# EAGLE design Quad_Schematic (EAGLE 8.0.0)
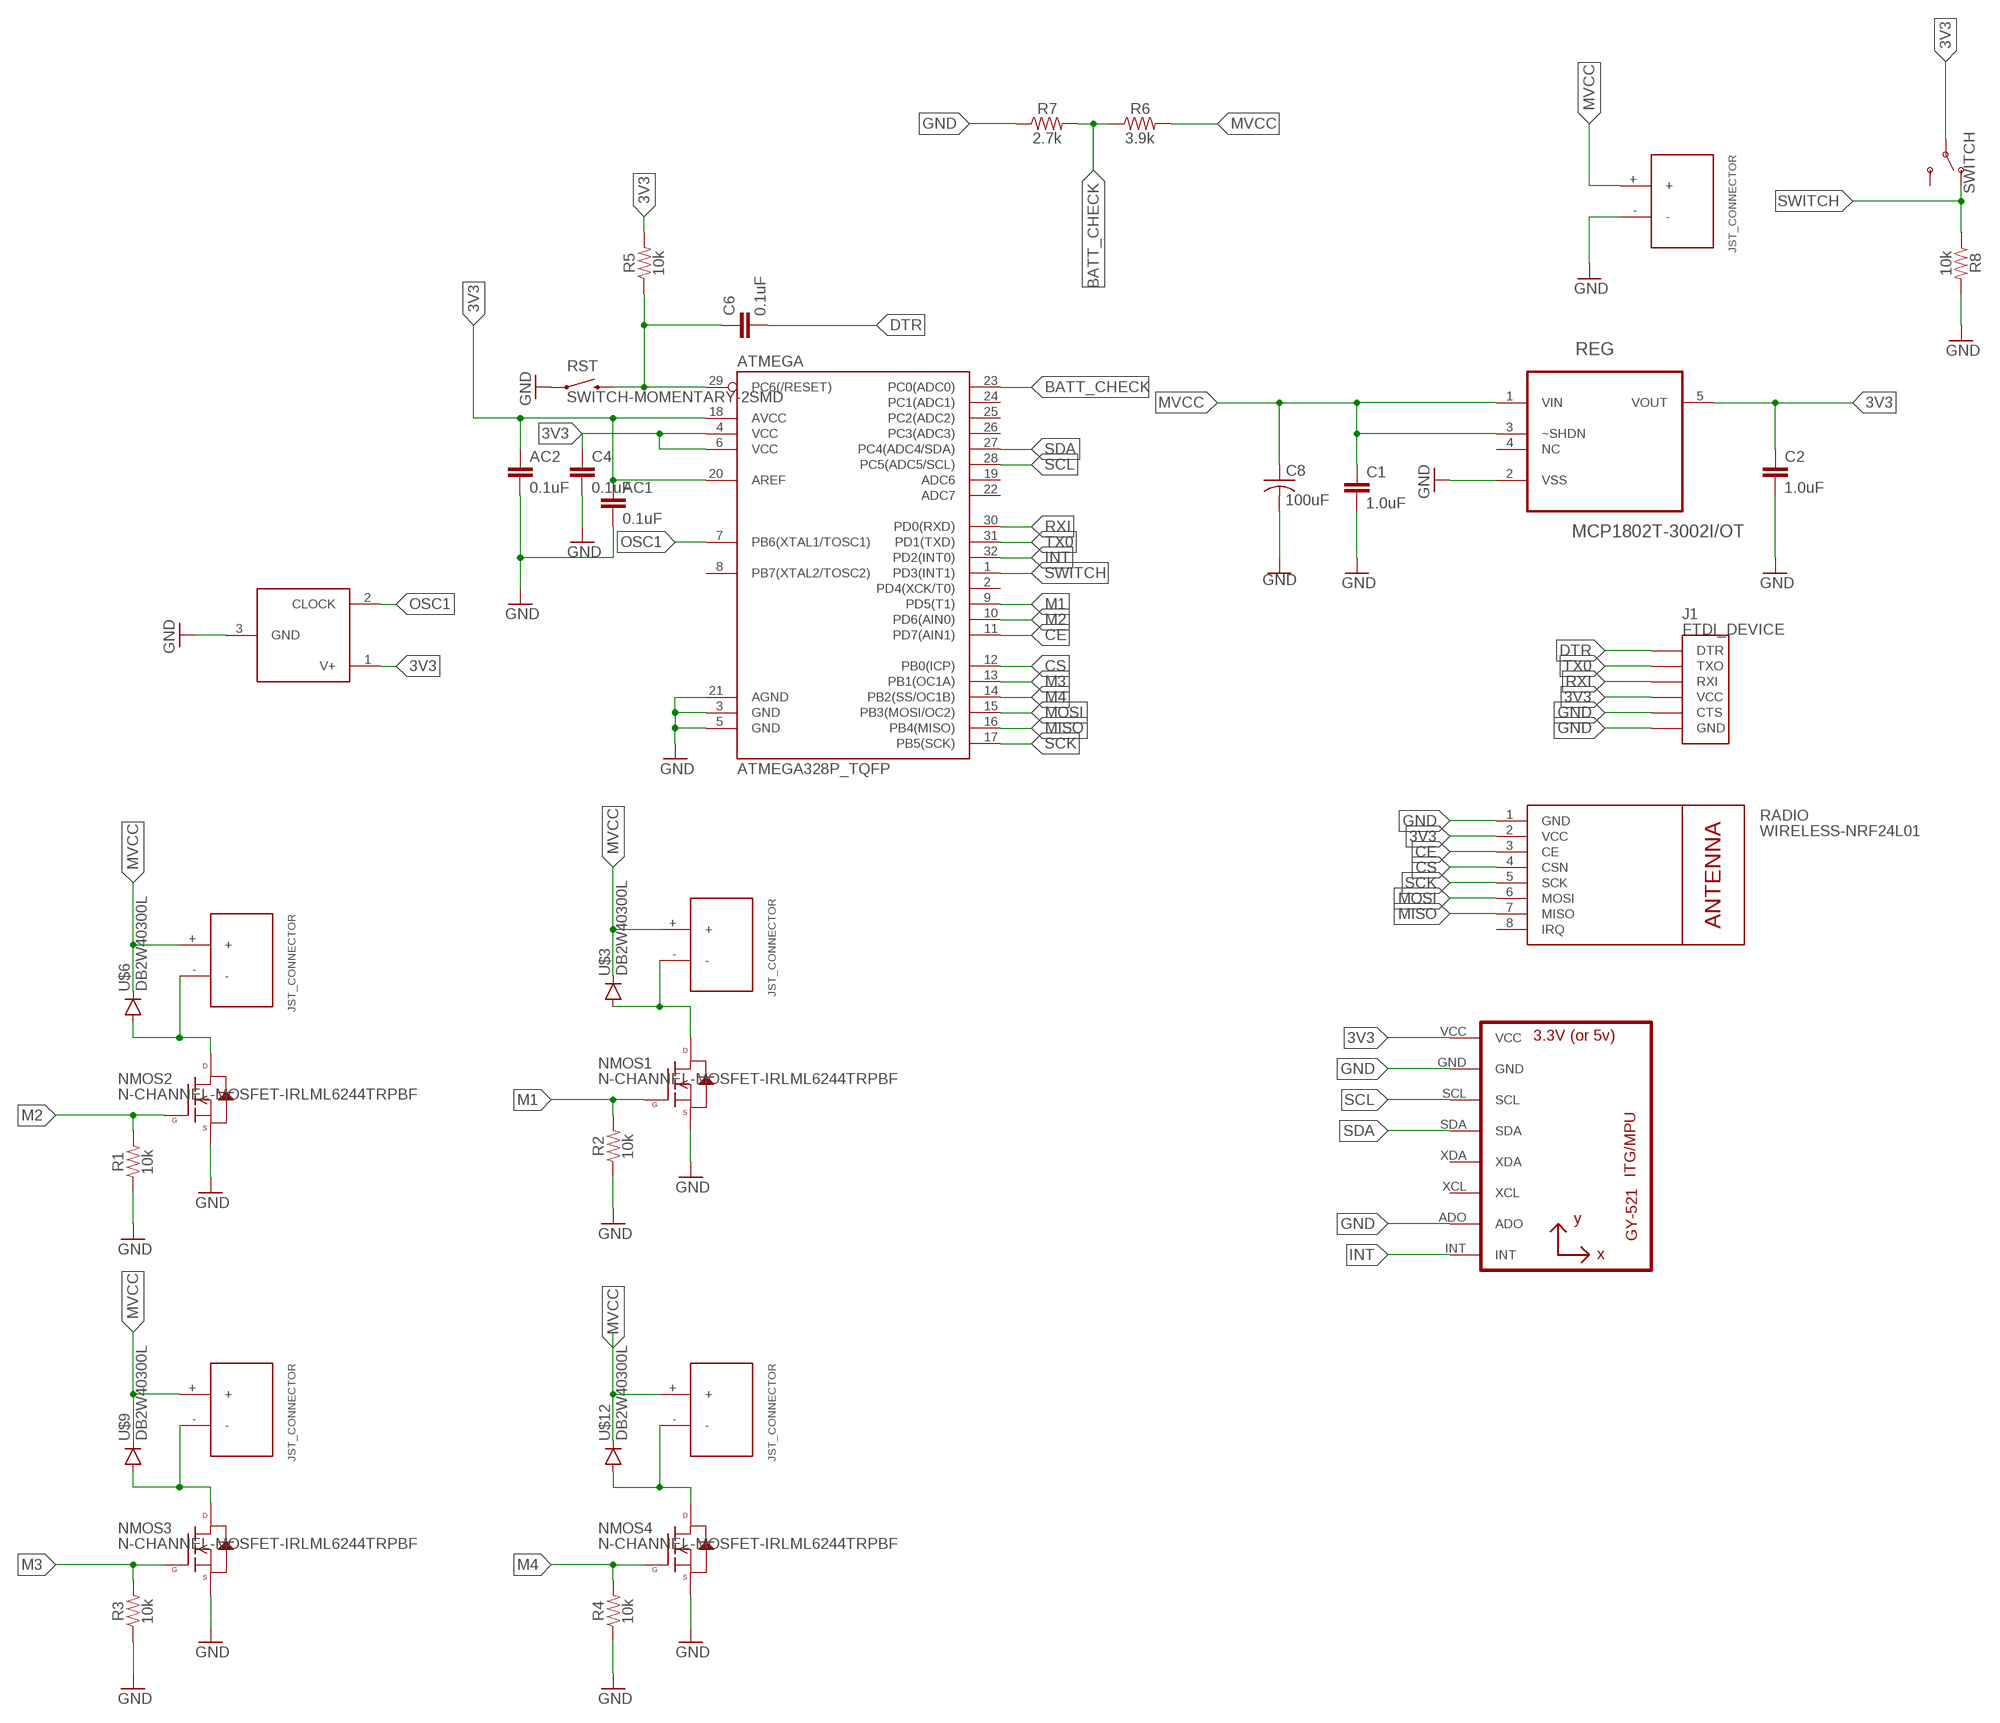
[diagram p0: schematic, sheet 1]

## Parts
AC1  0.1uF  0.1UF-0603-25V-5%  [0603]
AC2  0.1uF  0.1UF-0603-25V-5%  [0603]
ATMEGA  ATMEGA328P_TQFP  [TQFP32-08]
BATT  JST_CONNECTOR_FEMALE  [JST_CONNECTOR_FEMALE]
C1  1.0uF  1.0UF-0603-16V-10%  [0603]
C2  1.0uF  1.0UF-0603-16V-10%  [0603]
C4  0.1uF  0.1UF-0603-25V-5%  [0603]
C6  0.1uF  0.1UF-0603-25V-5%  [0603]
C8  100uF  C-USC1210  [C1210]
J1  FTDI_DEVICE  [FTDI_DEVICE_SIDE]
NMOS1  N-CHANNEL-MOSFET-IRLML6244TRPBF  [SOT23-3]
NMOS2  N-CHANNEL-MOSFET-IRLML6244TRPBF  [SOT23-3]
NMOS3  N-CHANNEL-MOSFET-IRLML6244TRPBF  [SOT23-3]
NMOS4  N-CHANNEL-MOSFET-IRLML6244TRPBF  [SOT23-3]
OSC  MAX7375  [SC70-3L]
R1  10k  10KOHM-0603-1/10W-1%  [0603]
R2  10k  10KOHM-0603-1/10W-1%  [0603]
R3  10k  10KOHM-0603-1/10W-1%  [0603]
R4  10k  10KOHM-0603-1/10W-1%  [0603]
R5  10k  10KOHM-0603-1/10W-1%  [0603]
R6  3.9k  6.8KOHM-0603-1/10W-1%  [0603]
R7  2.7k  5.6KOHM-0603-1/10W-1%  [0603]
R8  10k  10KOHM-0603-1/10W-1%  [0603]
RADIO  WIRELESS-NRF24L01  [WIRELESS-NRF24L01]
REG  MCP1802T-3002I/OT  [SOT95P270X145-5N]
RST  SWITCH-MOMENTARY-2SMD  [TACTILE-SWITCH-SMD]
SWITCH  SWITCH-SPDT-PTH-11.6X4.0MM  [SWITCH_SPDT_PTH_11.6X4.0MM]
U2  GY-521MPU6050  [GY-521]
U$2  JST_CONNECTOR_FEMALE  [JST_CONNECTOR_FEMALE]
U$3  DB2W40300L  [MINI2-F3-B]
U$5  JST_CONNECTOR_FEMALE  [JST_CONNECTOR_FEMALE]
U$6  DB2W40300L  [MINI2-F3-B]
U$8  JST_CONNECTOR_FEMALE  [JST_CONNECTOR_FEMALE]
U$9  DB2W40300L  [MINI2-F3-B]
U$11  JST_CONNECTOR_FEMALE  [JST_CONNECTOR_FEMALE]
U$12  DB2W40300L  [MINI2-F3-B]

## Nets
3V3: AC1.1 AC2.1 ATMEGA.4(VCC) ATMEGA.6(VCC) ATMEGA.18(AVCC) ATMEGA.20(AREF) C2.1 C4.1 J1.P$4(VCC) OSC.1(V+) R5.2 RADIO.2(VCC) REG.5(VOUT) SWITCH.2(P) U2.VCC
BATT_CHECK: ATMEGA.23(PC0(ADC0)) R6.1 R7.2
CE: ATMEGA.11(PD7(AIN1)) RADIO.3(CE)
CS: ATMEGA.12(PB0(ICP)) RADIO.4(CSN)
DTR: C6.2 J1.P$1(DTR)
GND: AC1.2 AC2.2 ATMEGA.3(GND) ATMEGA.5(GND) ATMEGA.21(AGND) BATT.- C1.2 C2.2 C4.2 C8.2 J1.P$5(CTS) J1.P$6(GND) NMOS1.2(S) NMOS2.2(S) NMOS3.2(S) NMOS4.2(S) OSC.3(GND) R1.1 R2.1 R3.1 R4.1 R7.1 R8.2 RADIO.1(GND) REG.2(VSS) RST.1 U2.ADO U2.GND
INT: ATMEGA.32(PD2(INT0)) U2.INT
M1: ATMEGA.9(PD5(T1)) NMOS1.1(G) R2.2
M2: ATMEGA.10(PD6(AIN0)) NMOS2.1(G) R1.2
M3: ATMEGA.13(PB1(OC1A)) NMOS3.1(G) R3.2
M4: ATMEGA.14(PB2(SS/OC1B)) NMOS4.1(G) R4.2
MISO: ATMEGA.16(PB4(MISO)) RADIO.7(MISO)
MOSI: ATMEGA.15(PB3(MOSI/OC2)) RADIO.6(MOSI)
MVCC: BATT.+ C1.1 C8.1 R6.2 REG.1(VIN) REG.3(~SHDN) U$2.+ U$3.NEG(GPIN) U$5.+ U$6.NEG(GPIN) U$8.+ U$9.NEG(GPIN) U$11.+ U$12.NEG(GPIN)
N$1: NMOS1.3(D) U$2.- U$3.POS(PPIN)
N$5: NMOS2.3(D) U$5.- U$6.POS(PPIN)
N$8: NMOS4.3(D) U$11.- U$12.POS(PPIN)
N$10: NMOS3.3(D) U$8.- U$9.POS(PPIN)
OSC1: ATMEGA.7(PB6(XTAL1/TOSC1)) OSC.2(CLOCK)
RESET: ATMEGA.29(PC6(/RESET)) C6.1 R5.1 RST.3
RXI: ATMEGA.30(PD0(RXD)) J1.P$3(RXI)
SCK: ATMEGA.17(PB5(SCK)) RADIO.5(SCK)
SCL: ATMEGA.28(PC5(ADC5/SCL)) U2.SCL
SDA: ATMEGA.27(PC4(ADC4/SDA)) U2.SDA
SWITCH: ATMEGA.1(PD3(INT1)) R8.1 SWITCH.1(O)
TX0: ATMEGA.31(PD1(TXD)) J1.P$2(TXO)
Unconnected: ATMEGA.2(PD4(XCK/T0)) ATMEGA.8(PB7(XTAL2/TOSC2)) ATMEGA.19(ADC6) ATMEGA.22(ADC7) ATMEGA.24(PC1(ADC1)) ATMEGA.25(PC2(ADC2)) ATMEGA.26(PC3(ADC3)) RADIO.8(IRQ) REG.4(NC) SWITCH.3(S) U2.XCL U2.XDA

## Library data of the parts
AC1 AC2 C4 C6 = SparkFun-Capacitors:0.1UF: 0.1µF ceramic capacitors A capacitor is a passive two-terminal electrical component used to store electrical energy temporarily in an electric field.; PROD_ID: CAP-08604
ATMEGA = quad:ATMEGA328P_TQFP; PROD_ID: IC-09069
BATT U$2 U$5 U$8 U$11 = quad:JST_CONNECTOR_FEMALE
C1 C2 = SparkFun-Capacitors:1.0UF: 1µF ceramic capacitors A capacitor is a passive two-terminal electrical component used to store electrical energy temporarily in an electric field.; PROD_ID: CAP-00868
C8 = rcl:C-US: CAPACITOR, American symbol
J1 = quad:FTDI_DEVICE: Connector which mates to FTDI basic or FTDI cable.
NMOS1-NMOS4 = quad:N-CHANNEL-MOSFET: N-Channel MOSFET Mode Field Effect Transistor; DATASHEET: http://www.mouser.com/ds/2/196/irlml6244pbf-936666.pdf; MOUSER: 942-IRLML6244TRPBF; URL: http://www.mouser.com/Search/ProductDetail.aspx?R=IRLML6244TRPBFvirtualkey57370000virtualkey942-IRLML6244TRPBF
OSC = quad:MAX7375
R1-R5 R8 = SparkFun-Resistors:10KOHM: 10kΩ resistor A resistor is a passive two-terminal electrical component that implements electrical resistance as a circuit element. Resistors act to reduce current flow, and, at the same time, act to lower voltage levels within circuits. - Wikipedia; PROD_ID: RES-00824
R6 = SparkFun-Resistors:6.8KOHM: 6.8kΩ resistor A resistor is a passive two-terminal electrical component that implements electrical resistance as a circuit element. Resistors act to reduce current flow, and, at the same time, act to lower voltage levels within circuits. - Wikipedia; PROD_ID: RES-08597; VALUE: 6.8k
R7 = SparkFun-Resistors:5.6KOHM: 5.6kΩ resistor A resistor is a passive two-terminal electrical component that implements electrical resistance as a circuit element. Resistors act to reduce current flow, and, at the same time, act to lower voltage levels within circuits. - Wikipedia; PROD_ID: RES-12378; VALUE: 5.6k
RADIO = quad:WIRELESS-NRF24L01: 2.4 GHz Wireless Module based on NRF24L01 chip
REG = quad:MCP1802T-3002I/OT: Low Quiescent Current LDO; MPN: MCP1802T-3002I/OT; OC_FARNELL: 1578373; OC_NEWARK: 54M4837; PACKAGE: SOT-5; SUPPLIER: Microchip
RST = quad:SWITCH-MOMENTARY-2: Various NO switches- pushbuttons, reed, etc; PROD_ID: SWCH-08247
SWITCH = SparkFun-Switches:SWITCH-SPDT: Single Pole, Double Throw (SPDT) Switch Single-pole, double-throw (SPDT) switch. Variant Overview SMD-AYZ0202 Surface Mount DPDT Switch <https://www.sparkfun.com/products/597> (COM-00597) Used on e.g. LilyPad Arduino USB - ATmega32U4 Board <https://www.sparkfun.com/products/12049> PTH-11.6X4.0MM SPDT Mini Power Switch <https://www.sparkfun.com/products/102> (COM-00102) Used on e.g. SparkFun Simon Says - Through-Hole Soldering Kit <https://www.sparkfun.com/products/10547> (KIT-10547) PTH-11.6X4.0MM-KIT KIT version of SPDT Mini Power Switch - Simplifies soldering by removing tStop of switch pins - only one side can be soldered. PTH-11.6X4.0MM-LOCK LOCK version of SPDT Mini Power Switch - Offset pins hold switch in place for easier soldering. SMD-RIGHT-ANGLE Surface Mount Right Angle Switch <https://www.sparkfun.com/products/10860> (COM-10860) Used on e.g. SparkFun ESP8266 Thing <https://www.sparkfun.com/products/13231>; PROD_ID: SWCH-08261; SF_SKU: COM-00102
U2 = quad:GY-521
U$3 U$6 U$9 U$12 = quad:DB2W40300L

## Board
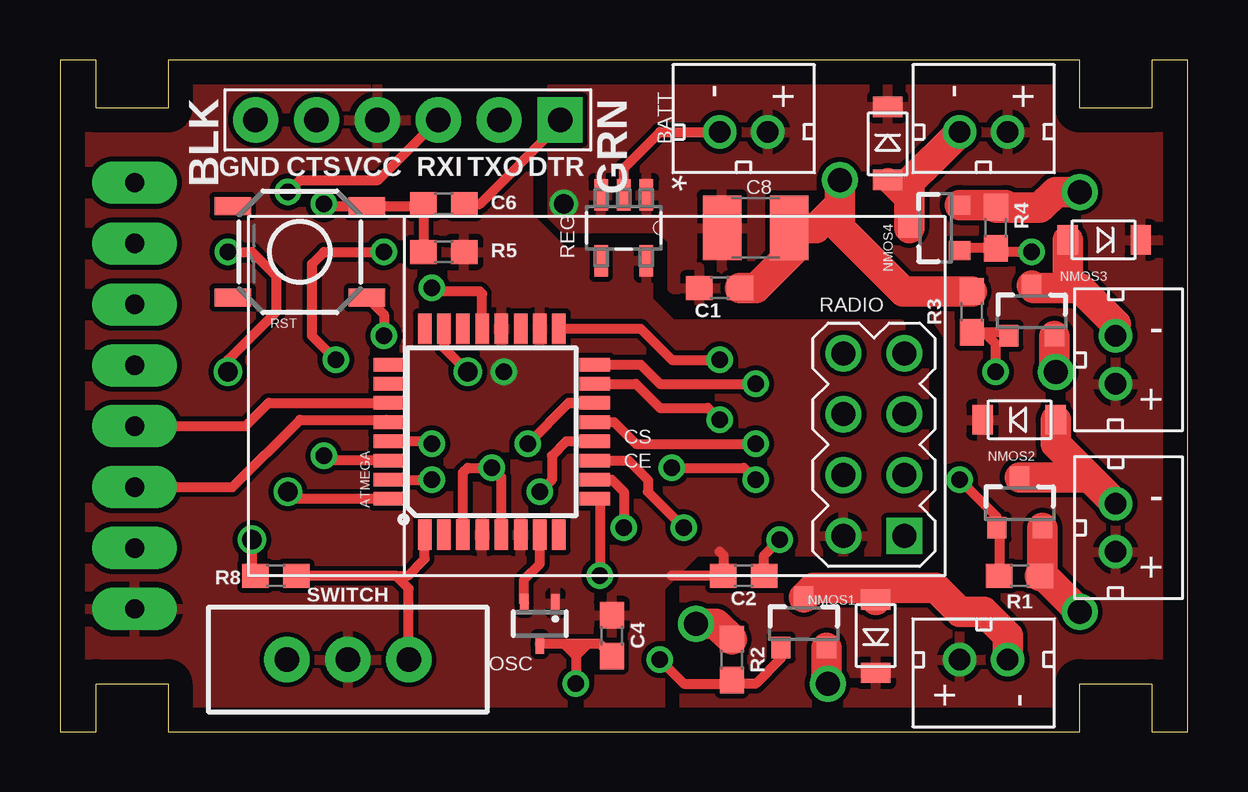
[diagram p1: board, top side]
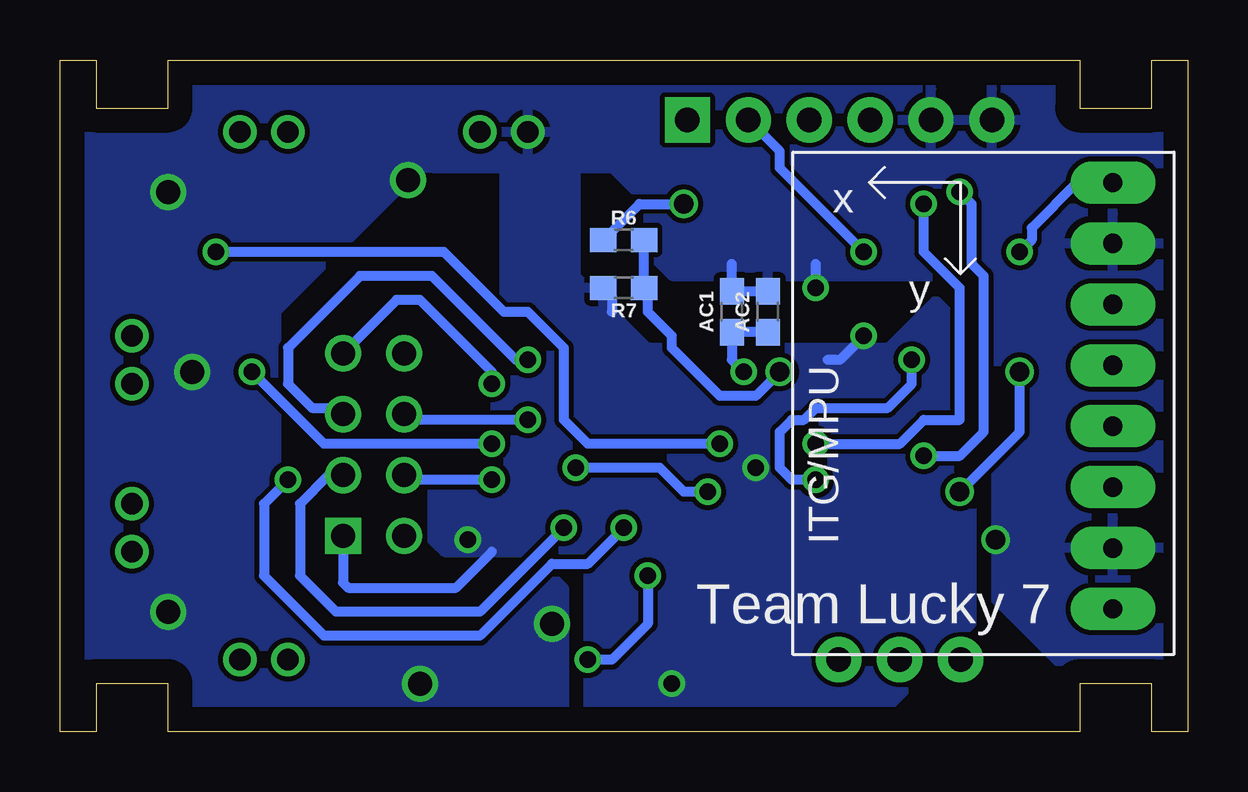
[diagram p2: board, bottom side, seen from below]

Size 47 x 28 mm. Coordinates in mm from the lower left corner, seen from the top.
Outline: 0,0 1.5,0 1.5,2 4.5,2 4.5,0 42.5,0 42.5,2 45.5,2 45.5,0 47,0 47,28 45.5,28 45.5,26 42.5,26 42.5,28 4.5,28 4.5,26 1.5,26 1.5,28 0,28 0,0
Copper layers (1*16): Top 0.035mm / dielectric 1.5mm / Bottom 0.035mm
Design rules "default": minimum track width 10mil, minimum drill 24mil, track to track 8mil, track to pad 8mil, pad to pad 8mil, via to via 8mil, smd to smd 8mil, copper to edge 40mil, drill to drill 8mil, minimum pad ring 10mil, minimum via ring 8mil, stop-mask expansion 4mil, vias tented up to drill 0mil, thermal gap 10mil

### Footprints (pad centres in the part's own frame; a part is rotated, then mirrored left to right if it is on the bottom)
0603 = smd 1.1 x 1: 1 -0.85,0; 2 0.85,0
TQFP32-08 = smd 1.27 x 0.559: 1 -4.293,2.8; 2 -4.293,2; 3 -4.293,1.2; 4 -4.293,0.4; 5 -4.293,-0.4; 6 -4.293,-1.2; 7 -4.293,-2; 8 -4.293,-2.8; 17 4.293,-2.8; 18 4.293,-2; 19 4.293,-1.2; 20 4.293,-0.4; 21 4.293,0.4; 22 4.293,1.2; 23 4.293,2; 24 4.293,2.8 | smd 0.559 x 1.27: 9 -2.8,-4.293; 10 -2,-4.293; 11 -1.2,-4.293; 12 -0.4,-4.293; 13 0.4,-4.293; 14 1.2,-4.293; 15 2,-4.293; 16 2.8,-4.293; 25 2.8,4.293; 26 2,4.293; 27 1.2,4.293; 28 0.4,4.293; 29 -0.4,4.293; 30 -1.2,4.293; 31 -2,4.293; 32 -2.8,4.293
JST_CONNECTOR_FEMALE = drill 0.889: + 0,1; - 0,-1
C1210 = smd 1.6 x 2.7: 1 -1.4,0; 2 1.4,0
FTDI_DEVICE_SIDE = drill 1.016 pad 1.88 square: P$1 -6.35,0 | drill 1.016 pad 1.88: P$2 -3.81,0; P$3 -1.27,0; P$4 1.27,0; P$5 3.81,0; P$6 6.35,0
SOT23-3 = smd 0.8 x 0.9: 1 -0.95,-1; 2 0.95,-1; 3 0,1.1
SC70-3L = smd 0.35 x 0.8: 1 -0.65,-0.85; 2 0.65,-0.85; 3 0,0.85
WIRELESS-NRF24L01 = drill 1 square: 1 -12.7,6.35 | drill 1: 2 -10.16,6.35; 3 -12.7,3.81; 4 -10.16,3.81; 5 -12.7,1.27; 6 -10.16,1.27; 7 -12.7,-1.27; 8 -10.16,-1.27
SOT95P270X145-5N = smd 1.321 x 0.559: 1 -1.372,0.94; 2 -1.372,0; 3 -1.372,-0.94; 4 1.372,-0.94; 5 1.372,0.94
TACTILE-SWITCH-SMD = smd 1.524 x 0.762: 1 -2.794,1.905; 2 2.794,1.905; 3 -2.794,-1.905; 4 2.794,-1.905
SWITCH_SPDT_PTH_11.6X4.0MM = drill 1.016 pad 1.88: 1 0,2.54; 2 0,0; 3 0,-2.54
GY-521 = drill 0.8 pad 1.778 long: ADO -8.89,-6.35; GND -8.89,6.35; INT -8.89,-8.89; SCL -8.89,3.81; SDA -8.89,1.27; VCC -8.89,8.89; XCL -8.89,-3.81; XDA -8.89,-1.27
MINI2-F3-B = smd 1.22 x 0.85: NEG 0,1.55; POS 0,-1.5

### Placement (x,y rotation side)
AC1  19,17.5 90 bottom
AC2  17.5,17.5 90 bottom
ATMEGA  18,12.5 90 top
BATT  28.5,25 270 top
C1  27.5,18.5 0 top
C2  28.5,6.5 0 top
C4  23,4 270 top
C6  16,22 0 top
C8  29,21 0 top
J1  14.5,25.5 180 top
NMOS1  31,4.5 0 top
NMOS2  40,9.5 0 top
NMOS3  40.5,17.5 0 top
NMOS4  36.5,21 90 top
OSC  20,4.5 180 top
R1  40,6.5 180 top
R2  28,3 270 top
R3  38,17.5 270 top
R4  39,21 270 top
R5  16,20 0 top
R6  23.5,20.5 180 bottom
R7  23.5,18.5 0 bottom
R8  9,6.5 180 top
RADIO  22.5,14.5 180 top
REG  23.5,21 270 top
RST  10,20 180 top
SWITCH  12,3 270 top
U2  12,14 180 bottom
U$2  38.5,3 90 top
U$3  34,4 180 top
U$5  44,8.5 180 top
U$6  40,13 90 top
U$8  44,15.5 180 top
U$9  43.5,20.5 270 top
U$11  38.5,25 270 top
U$12  34.5,24.5 0 top

### Tracks (layer width: path | path; a pad name or v marks a point on that pad's centre or on a via)
3V3  (via drill 0.7)
  Top 0.406: 27.5,7.5 27.65,7.35 C2.1 25.5,6.5
  Bottom 0.406: AC2.1 AC1.1 19,15.5 v18.5,15
  pour Top: 19.5,28 19.5,21.5 21,20 24.5,20 24.5,18 25.5,17 35,17 36,16 36,8 35.5,7.5 26.5,7.5 25,6 25,0 4.5,0 4.5,2 0,2 0,26 4.5,26 4.5,28
BATT_CHECK  (via drill 0.8)
  Top 0.406: ATMEGA.23 16,16 v17,15
  Bottom 0.406: R6.1 R7.2 22.5,18.35 22.5,17.5 21.5,16.5 21.5,16 19.5,14 18,14 v17,15
CE  (via drill 0.7)
  Top 0.406: ATMEGA.11 23.7,11.3 24.5,10.5 24.5,10 v26,8.5
  Bottom 0.406: RADIO.3 35.81,10.69 37,9.5 37,6.5 35.5,5 29.5,5 v26,8.5
CS  (via drill 0.7)
  Top 0.406: 21.6,12.1 ATMEGA.12 21.1,12.1 20.5,11.5 20.5,10.5 v20,10 | v25.5,11 28.5,11 v29,10.5
  Bottom 0.406: v29,10.5 32.47,10.5 RADIO.4 | v20,10 21,10 22,11 v25.5,11
DTR
  Top 0.406: C6.2 17.5,22 20.85,25.35 J1.P$1
GND  (via drill 0.7, 0.8, 1)
  Top 0.406: 21,3.65 OSC.3 | 22,3.65 22.5,3.65 C4.2 | 12.6,18.09 RST.1 13.5,17.39 v13.5,16.5 | 31.95,2.05 v32,2 | ATMEGA.5 18.4,10.6 v18,11 17,11 16.8,10.8 ATMEGA.3 | R8.2 8,6.65 v8,8 | 21.5,3.65 v21.5,2 | 21,3.65 21.5,3.15 22,3.65 | 21.5,3.65 21,3.65 | C8.2 30.5,20.9 30.5,20 | 22,3.65 21.5,3.65 | REG.2 23.5,23.5 25,25 BATT.- | C2.2 29.35,7.35 v30,8 | ATMEGA.21 17.6,18.25 AC2.2 15.65,18.35 v15.5,18.5
  Top 1.27: NMOS4.2 39.4,21.95 R4.1 40.85,21.85 41.5,22.5 v42.5,22.5 | R3.1 35.15,18.35 32.5,21 32.5,22 | NMOS2.2 40.95,6.6 R1.1 41,6.5 v42.5,5 | NMOS1.2 31.95,2.05 | 32.5,22 v32.5,23 | C8.2 31.5,21 32.5,22 | NMOS3.2 41.45,15.05 v41.5,15 | C1.2 29,18.5 30.5,20 | R2.1 27.35,4.5 v26.5,4.5
  Bottom 0.406: RADIO.1 35.2,6.2 35,6 30.5,6 29,7.5 | R7.1 24,18.15 24,17.5 | v13.5,16.5 14.5,15.5 15,15.5 | AC2.2 AC1.2 19,19.5 | v15.5,18.5 15.5,19.5
  pour Bottom: 31.5,28 31.5,23.5 24,23.5 22.5,22 22.5,20 21.5,19 10,19 8,17 8,5.5 4.5,2 0,2 0,26 4.5,26 6.5,28
  pour Bottom: 26,6 26.5,6.5 27.5,6.5
  pour Bottom: 25.5,28 28.5,28 28.5,14 31.5,11 31.5,8 31,7.5 26,7.5 25,6.5 25,0.5 24.5,0 13.5,0 9,4.5 9,16.5 10.5,18 12.5,16 22.5,16 25.5,19
  pour Bottom: 25.5,28 25.5,23.5 31.5,23.5 32,23.5 38,17.5 38,6.5 36,4.5 30,4.5 29.5,4.5 27.5,6.5 26.5,6.5 26,6 26,0.5 26.5,0 40.5,0 42.5,2 47,2 47,26 42.5,26 40.5,28
INT  (via drill 0.7, 0.8)
  Top 0.406: ATMEGA.32 9.8,9.7 v9.5,10 | v7,15 7,15.5 9,17.5 9,19 8,20 v7,20
  Bottom 0.406: v9.5,10 7,12.5 v7,15 | U2.INT 4.61,22.89 6.5,21 6.5,20.5 v7,20
M1  (via drill 0.7)
  Top 0.406: ATMEGA.9 22.5,9.49 v22.5,6.5 | v25,3 26,2 27.85,2 R2.2 28.15,2 29,2 30.05,3.05 NMOS1.1
  Bottom 0.406: v22.5,6.5 22.5,4.5 24,3 v25,3
M2  (via drill 0.7)
  Top 0.406: R1.2 39.15,8.4 NMOS2.1 39.05,8.95 v37.5,10.5 | ATMEGA.10 23,10.5 23.5,10 v23.5,8.5
  Bottom 0.406: v37.5,10.5 38.5,9.5 38.5,6.5 36,4 29.5,4 26.5,7 25,7 v23.5,8.5
M3  (via drill 0.7)
  Top 0.406: 38.5,16.65 R3.2 | 38.5,16.65 39.4,16.65 NMOS3.1 | v39,15 39,16.15 38.5,16.65 | ATMEGA.13 23.1,12.9 24,12 v29,12
  Bottom 0.406: v29,12 36,12 v39,15
M4  (via drill 0.7)
  Top 0.406: NMOS4.1 37.6,20.15 R4.2 39.15,20 v40.5,20 | 21.2,13.7 ATMEGA.14 21.2,13.7 | 21.2,13.7 v19.5,12
  Bottom 0.406: v40.5,20 31,20 28.5,17.5 27.5,17.5 26,16 26,13 25,12 v19.5,12
MISO  (via drill 0.7)
  Top 0.406: ATMEGA.16 24.2,15.3 25,14.5 v29,14.5
  Bottom 0.406: 35,15.97 RADIO.7 32.97,18 32,18 29,15 v29,14.5
MOSI  (via drill 0.7)
  Top 0.406: ATMEGA.15 24,14.5 25,13.5 27,13.5 v27.5,13
  Bottom 0.406: v27.5,13 32.43,13 RADIO.6
MVCC  (via drill 0.8)
  Bottom 0.406: R6.2 22.85,22 v21,22
  pour Top: 20.5,28 20.5,21.5 21,21 25,21 25.5,20.5 25.5,18.5 26.5,18 36,18 37,16.5 37,8 36,6.5 27,6.5 26,6 26,0 42.5,0 42.5,2 47,2 47,26 42.5,26 42.5,28
N$1
  Top 0.406: NMOS1.3 31.1,5.5
  Top 1.27: U$2.- 39.5,4 38.5,5 37.5,5 36.5,6 34.5,6 | 34.5,6 U$3.POS | 34.5,6 31.4,6 NMOS1.3
N$5
  Top 1.27: 42.9,10.6 NMOS2.3 | 42.9,10.6 U$5.- | U$6.POS 41.5,12 42.9,10.6
N$8
  Top 1.016: NMOS4.3 35.4,22.1 U$12.POS
  Top 1.27: 36,23.5 U$11.- 35.4,22.9 NMOS4.3
N$10
  Top 0.406: U$8.- 44,17 | 42,19 41.5,18.5
  Top 1.27: 44,17 42.5,18.5 41.5,18.5 40.6,18.5 NMOS3.3 | U$9.POS 42,19
OSC1
  Top 0.406: OSC.2 19.35,6.35 20,7 ATMEGA.7
RESET  (via drill 0.7)
  Top 0.406: R5.1 C6.1 15.05,21.91 RST.3 11.1,21.91 v11,22 | v15.5,12 15.4,12.1 ATMEGA.29
  Bottom 0.406: v15.5,12 12,12 11,13 9.5,13 9.5,18.5 11,20 v11,22
RXI  (via drill 0.7)
  Top 0.406: 15.5,25.5 J1.P$3 13.27,23 10,23 v9.5,22.5 | v11,11.5 11.2,11.3 ATMEGA.30
  Bottom 0.406: v11,11.5 9.5,11.5 8.5,12.5 8.5,19 9,19.5 9,22 v9.5,22.5
SCK  (via drill 0.7)
  Top 0.406: ATMEGA.17 24.21,16.79 25.5,15.5 v27.5,15.5
  Bottom 0.406: RADIO.5 35.47,13.5 36.5,13.5 37.5,14.5 37.5,16 34.5,19 31.5,19 28,15.5 v27.5,15.5
SCL
  Top 0.406: U2.SCL 7.19,10.19 10,13 13.61,13 ATMEGA.28
SDA
  Top 0.406: U2.SDA 7.73,12.73 8.7,13.7 ATMEGA.27
SWITCH
  Top 0.406: 14,6.5 14.5,6.5 15.2,7.2 ATMEGA.1 | 14,6.5 R8.1 | SWITCH.1 14.54,5.96 14,6.5
TX0  (via drill 0.7)
  Top 0.406: ATMEGA.31 v15.5,10.5 | v11.5,15.5 10.5,16.5 10.5,19.5 11,20 v13.5,20
  Bottom 0.406: v15.5,10.5 16.5,10.5 17,11 17,12.5 16.5,13 16,13 15.5,13.5 12.5,13.5 11.5,14.5 v11.5,15.5 | J1.P$2 17,24.19 17,23.5 v13.5,20

### Text on the board
tPlace: BATT | CS | CE
bPlace: Team Lucky 7